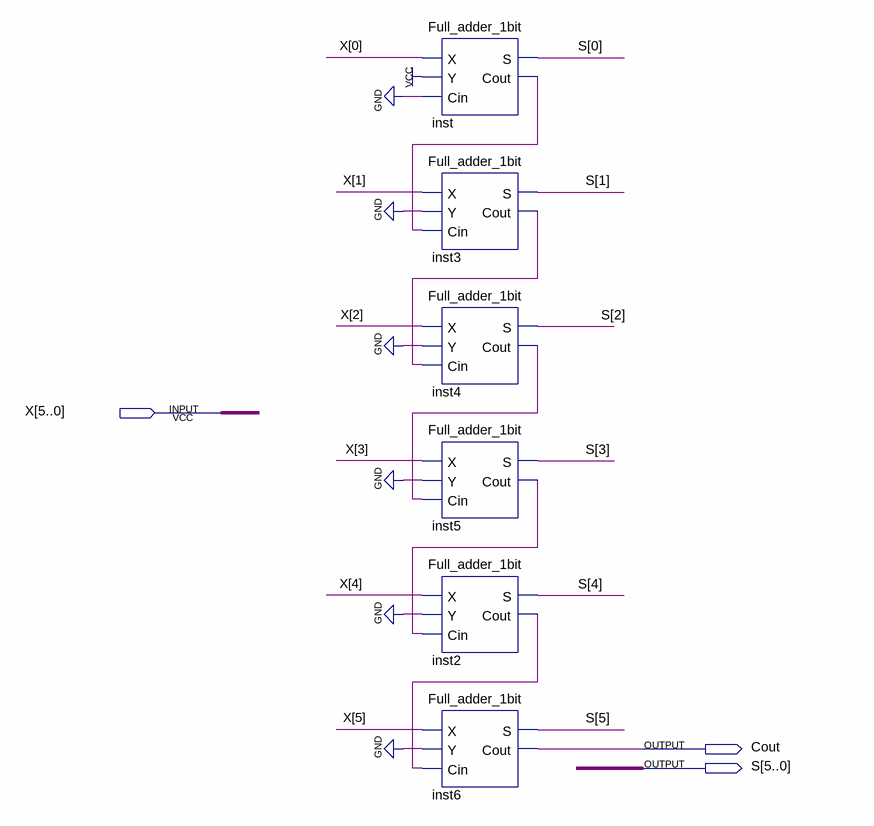
[diagram p0: schematic sheet]
// Quartus schematic PC_Adder6.bdf as structural Verilog: 6 symbols, 3 pins
module PC_Adder6 (
  input  [5:0] X,
  output Cout,
  output [5:0] S
);

  wire inst2_cout, inst3_cout, inst4_cout, inst5_cout, inst_cout;

  Full_adder_1bit inst (.X(X[0]), .Y(1'b1), .Cin(1'b0), .S(S[0]), .Cout(inst_cout));
  Full_adder_1bit inst3 (.X(X[1]), .Y(1'b0), .Cin(inst_cout), .S(S[1]), .Cout(inst3_cout));
  Full_adder_1bit inst4 (.X(X[2]), .Y(1'b0), .Cin(inst3_cout), .S(S[2]), .Cout(inst4_cout));
  Full_adder_1bit inst5 (.X(X[3]), .Y(1'b0), .Cin(inst4_cout), .S(S[3]), .Cout(inst5_cout));
  Full_adder_1bit inst2 (.X(X[4]), .Y(1'b0), .Cin(inst5_cout), .S(S[4]), .Cout(inst2_cout));
  Full_adder_1bit inst6 (.X(X[5]), .Y(1'b0), .Cin(inst2_cout), .S(S[5]), .Cout(Cout));
endmodule
